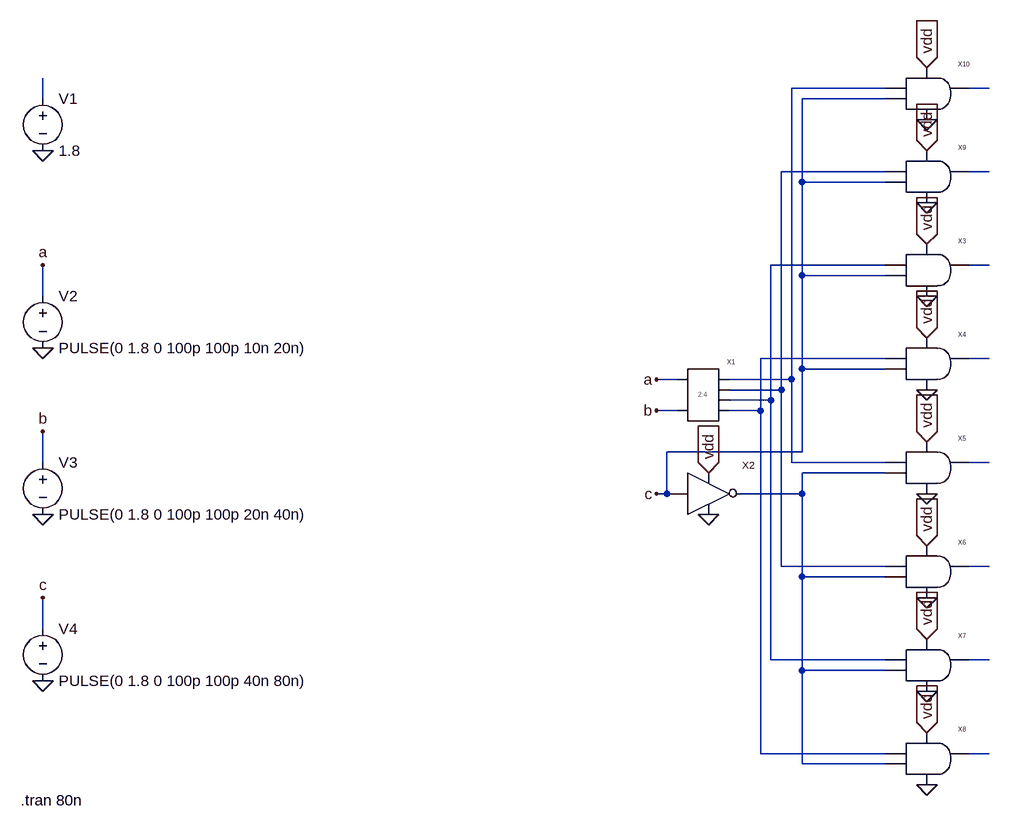
[diagram p0: schematic predecoded_decoder.asc]
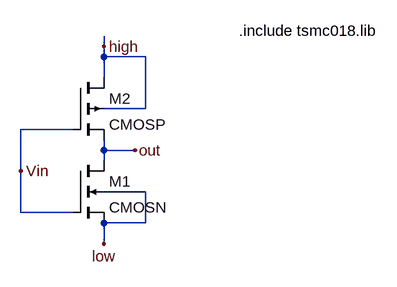
[diagram p1: sub-circuit inverter.asc]
predecoded_decoder.asc, the LTspice schematic file:
Version 4
SHEET 1 880 744
WIRE 384 -368 240 -368
WIRE 544 -368 512 -368
WIRE -912 -352 -912 -384
WIRE 384 -352 256 -352
WIRE 384 -240 224 -240
WIRE 544 -240 512 -240
WIRE 256 -224 256 -352
WIRE 384 -224 256 -224
WIRE 384 -96 208 -96
WIRE 544 -96 512 -96
WIRE 256 -80 256 -224
WIRE 384 -80 256 -80
WIRE -912 -48 -912 -96
WIRE 384 48 192 48
WIRE 544 48 512 48
WIRE 256 64 256 -80
WIRE 384 64 256 64
WIRE 64 80 32 80
WIRE 240 80 240 -368
WIRE 240 80 144 80
WIRE 224 96 224 -240
WIRE 224 96 144 96
WIRE 208 112 208 -96
WIRE 208 112 144 112
WIRE 64 128 32 128
WIRE 192 128 192 48
WIRE 192 128 144 128
WIRE 256 192 256 64
WIRE 256 192 48 192
WIRE -912 208 -912 160
WIRE 240 208 240 80
WIRE 384 208 240 208
WIRE 544 208 512 208
WIRE 384 224 256 224
WIRE 48 256 48 192
WIRE 48 256 32 256
WIRE 256 256 256 224
WIRE 256 256 160 256
WIRE 224 368 224 96
WIRE 384 368 224 368
WIRE 544 368 512 368
WIRE 256 384 256 256
WIRE 384 384 256 384
WIRE -912 464 -912 416
WIRE 208 512 208 112
WIRE 384 512 208 512
WIRE 544 512 512 512
WIRE 256 528 256 384
WIRE 384 528 256 528
WIRE 192 656 192 128
WIRE 384 656 192 656
WIRE 544 656 512 656
WIRE 256 672 256 528
WIRE 384 672 256 672
FLAG 448 -400 vdd
IOPIN 448 -400 In
FLAG 448 -272 vdd
IOPIN 448 -272 In
FLAG 448 -128 vdd
IOPIN 448 -128 In
FLAG 448 16 vdd
IOPIN 448 16 In
FLAG 448 176 vdd
IOPIN 448 176 In
FLAG 448 336 vdd
IOPIN 448 336 In
FLAG 448 480 vdd
IOPIN 448 480 In
FLAG 448 624 vdd
IOPIN 448 624 In
FLAG 112 224 vdd
IOPIN 112 224 In
FLAG 112 288 0
FLAG 448 704 0
FLAG 448 560 0
FLAG 448 416 0
FLAG 448 256 0
FLAG 448 96 0
FLAG 448 -48 0
FLAG 448 -192 0
FLAG 448 -320 0
FLAG -912 -272 0
FLAG -912 32 0
FLAG -912 288 0
FLAG -912 544 0
FLAG -912 -96 a
FLAG 32 80 a
FLAG -912 160 b
FLAG 32 128 b
FLAG -912 416 c
FLAG 32 256 c
SYMBOL 2_4_decoder 128 128 R0
SYMATTR InstName X1
SYMBOL Inverter 144 272 R0
SYMATTR InstName X2
SYMBOL and 496 -80 R0
SYMATTR InstName X3
SYMBOL and 496 64 R0
SYMATTR InstName X4
SYMBOL and 496 224 R0
SYMATTR InstName X5
SYMBOL and 496 384 R0
SYMATTR InstName X6
SYMBOL and 496 528 R0
SYMATTR InstName X7
SYMBOL and 496 672 R0
SYMATTR InstName X8
SYMBOL and 496 -224 R0
SYMATTR InstName X9
SYMBOL and 496 -352 R0
SYMATTR InstName X10
SYMBOL voltage -912 -368 R0
WINDOW 123 0 0 Left 0
WINDOW 39 0 0 Left 0
SYMATTR InstName V1
SYMATTR Value 1.8
SYMBOL voltage -912 -64 R0
WINDOW 123 0 0 Left 0
WINDOW 39 0 0 Left 0
SYMATTR InstName V2
SYMATTR Value PULSE(0 1.8 0 100p 100p 10n 20n)
SYMBOL voltage -912 192 R0
WINDOW 123 0 0 Left 0
WINDOW 39 0 0 Left 0
SYMATTR InstName V3
SYMATTR Value PULSE(0 1.8 0 100p 100p 20n 40n)
SYMBOL voltage -912 448 R0
WINDOW 123 0 0 Left 0
WINDOW 39 0 0 Left 0
SYMATTR InstName V4
SYMATTR Value PULSE(0 1.8 0 100p 100p 40n 80n)
TEXT -946 728 Left 2 !.tran 80n

inverter.asc, the sub-circuit schematic file:
Version 4
SHEET 1 880 680
WIRE 192 -16 192 -32
WIRE 192 0 192 -16
WIRE 256 0 192 0
WIRE 192 32 192 0
WIRE 256 80 256 0
WIRE 256 80 192 80
WIRE 144 112 64 112
WIRE 192 144 192 128
WIRE 240 144 192 144
WIRE 192 160 192 144
WIRE 64 176 64 112
WIRE 256 208 192 208
WIRE 64 240 64 176
WIRE 144 240 64 240
WIRE 256 256 256 208
WIRE 256 256 192 256
WIRE 192 288 192 256
FLAG 64 176 Vin
FLAG 192 -16 high
FLAG 192 288 low
FLAG 240 144 out
SYMBOL cmosn 144 160 R0
SYMATTR InstName M1
SYMATTR Value2 l=180n w=1u
SYMBOL cmosp 144 32 R0
SYMATTR InstName M2
SYMATTR Value2 l=180n w=1200n
TEXT 400 -40 Left 2 !.include tsmc018.lib

The netlist it stands for:
* predecoded_decoder.asc
XX1 a b N001 N004 N006 N008 2_4_decoder  ; pins A B y0 y1 y2 y3
XX2 vdd 0 c N011 inverter
XX3 N006 c vdd 0 N007 and  ; pins a b vdd vss And
XX4 N008 c vdd 0 N009 and  ; pins a b vdd vss And
XX5 N001 N011 vdd 0 N010 and  ; pins a b vdd vss And
XX6 N004 N011 vdd 0 N012 and  ; pins a b vdd vss And
XX7 N006 N011 vdd 0 N013 and  ; pins a b vdd vss And
XX8 N008 N011 vdd 0 N014 and  ; pins a b vdd vss And
XX9 N004 c vdd 0 N005 and  ; pins a b vdd vss And
XX10 N001 c vdd 0 N002 and  ; pins a b vdd vss And
V1 N003 0 1.8
V2 a 0 PULSE(0 1.8 0 100p 100p 10n 20n)
V3 b 0 PULSE(0 1.8 0 100p 100p 20n 40n)
V4 c 0 PULSE(0 1.8 0 100p 100p 40n 80n)

* block symbol definitions
.subckt inverter high low Vin out
M1 out Vin low low CMOSN l=180n w=1u
M2 high Vin out high CMOSP l=180n w=1200n
.include tsmc018.lib
.ends inverter

.model NMOS NMOS
.model PMOS PMOS
.lib standard.mos
.tran 80n
.backanno
.end

* Results of the author's LTspice run, read from the files saved beside the schematic
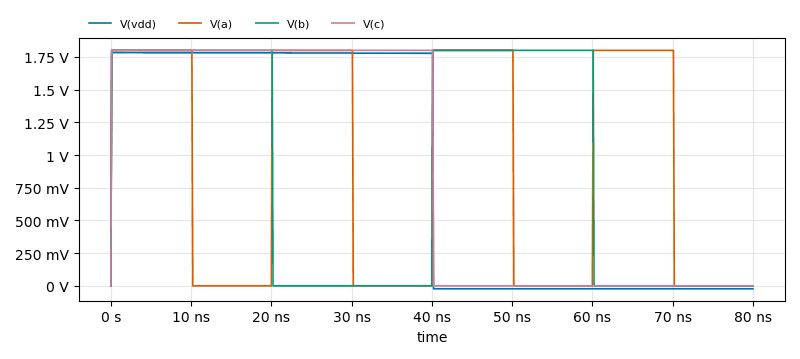
[diagram p2: Transient Analysis of predecoded_decoder.asc, plotted from the saved traces]
* Transient Analysis, 1 run:
*   V(vdd): min -22.73 mV, max 1.783 V, average 881.3 mV, rms 1.26 V, last -22.73 mV
*   V(a): min 0 V, max 1.8 V, average 909 mV, rms 1.277 V, last 0 V
*   V(b): min 0 V, max 1.8 V, average 904.5 mV, rms 1.275 V, last 0 V
*   V(c): min 0 V, max 1.8 V, average 902.2 mV, rms 1.274 V, last 0 V